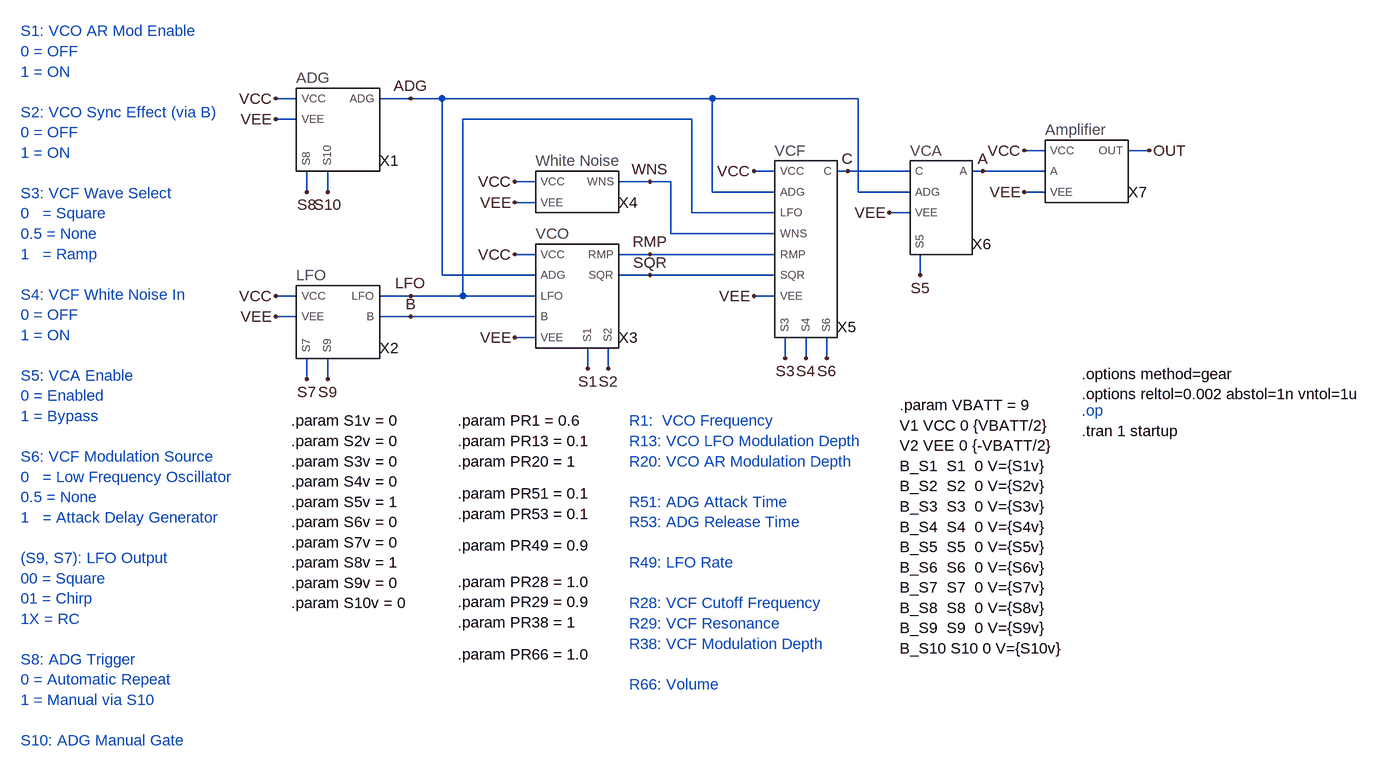
[diagram p0: schematic NoiseToaster.asc]
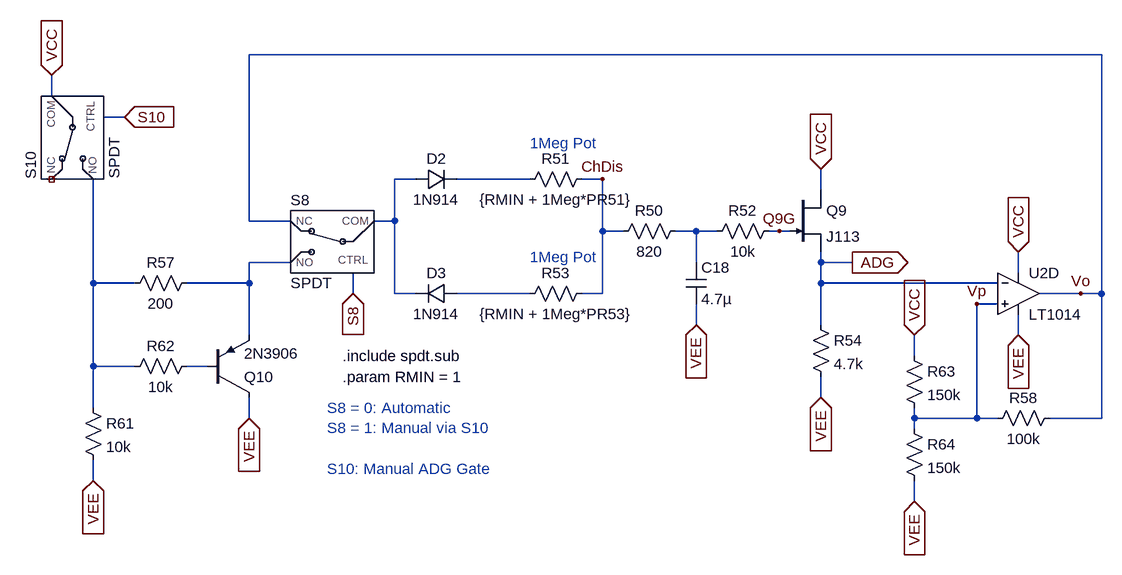
[diagram p1: sub-circuit adg.asc]
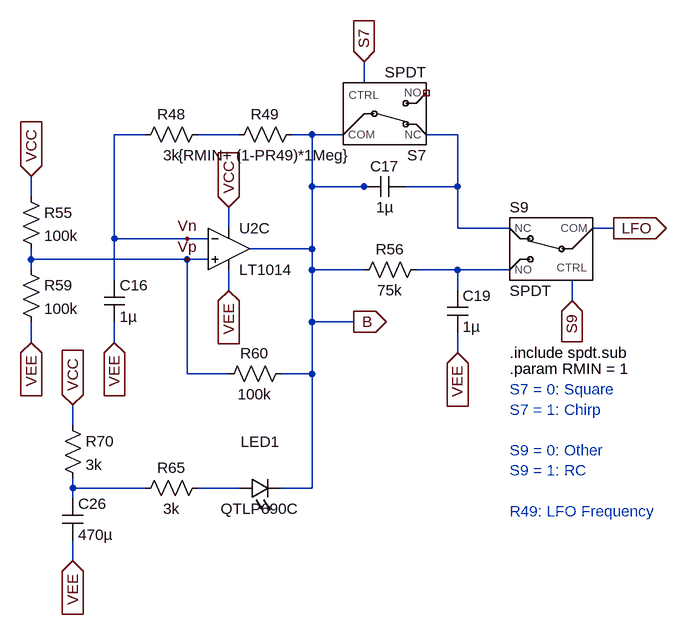
[diagram p2: sub-circuit lfo.asc]
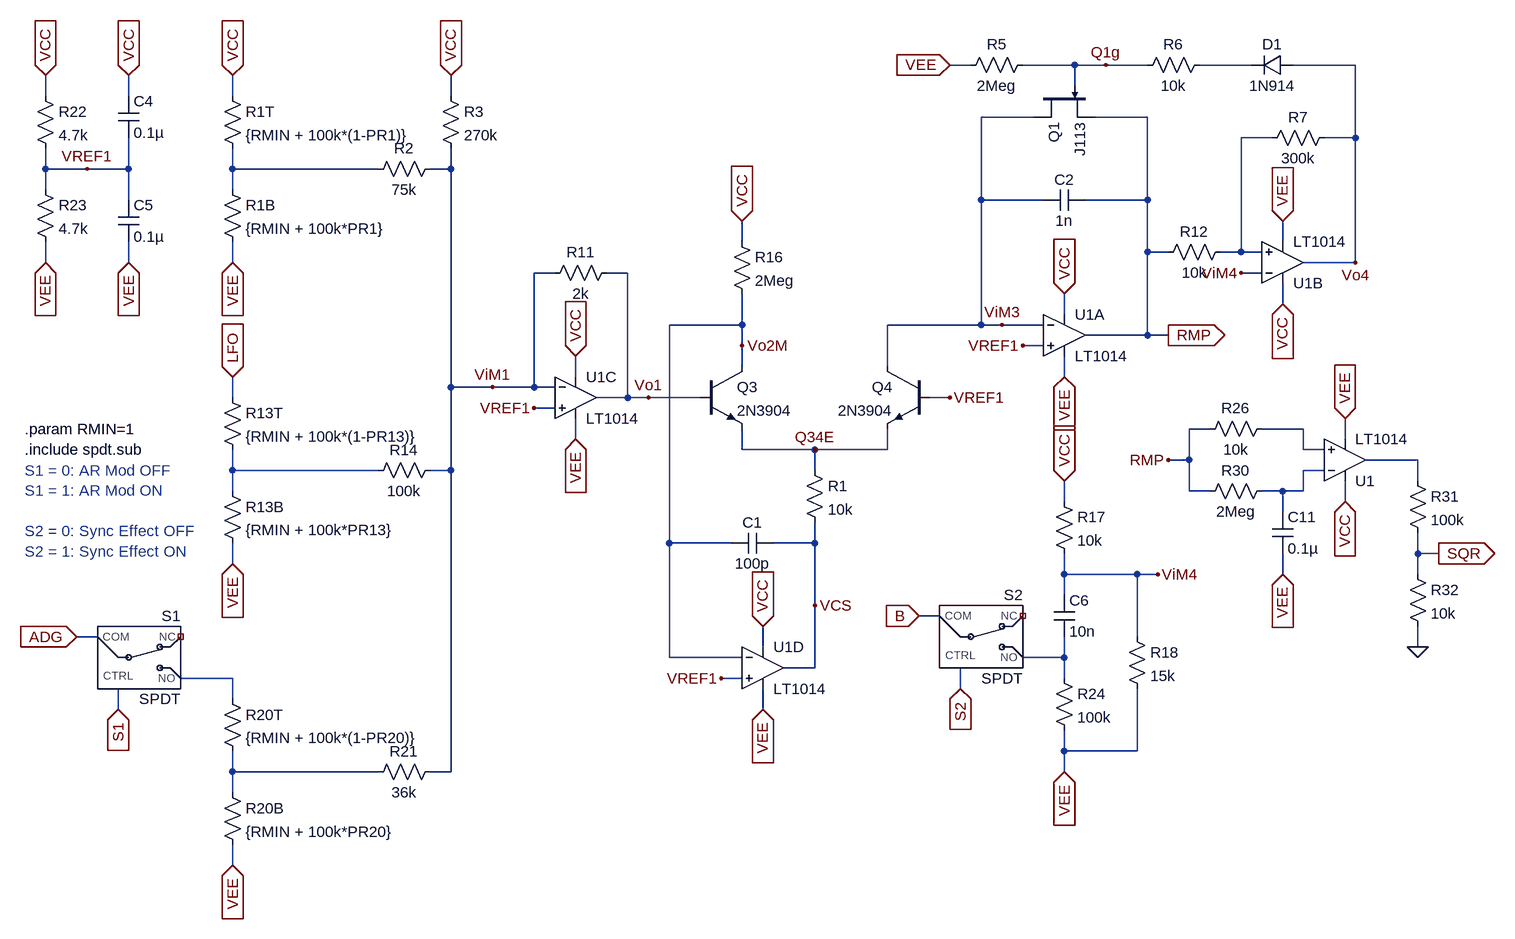
[diagram p3: sub-circuit vco.asc]
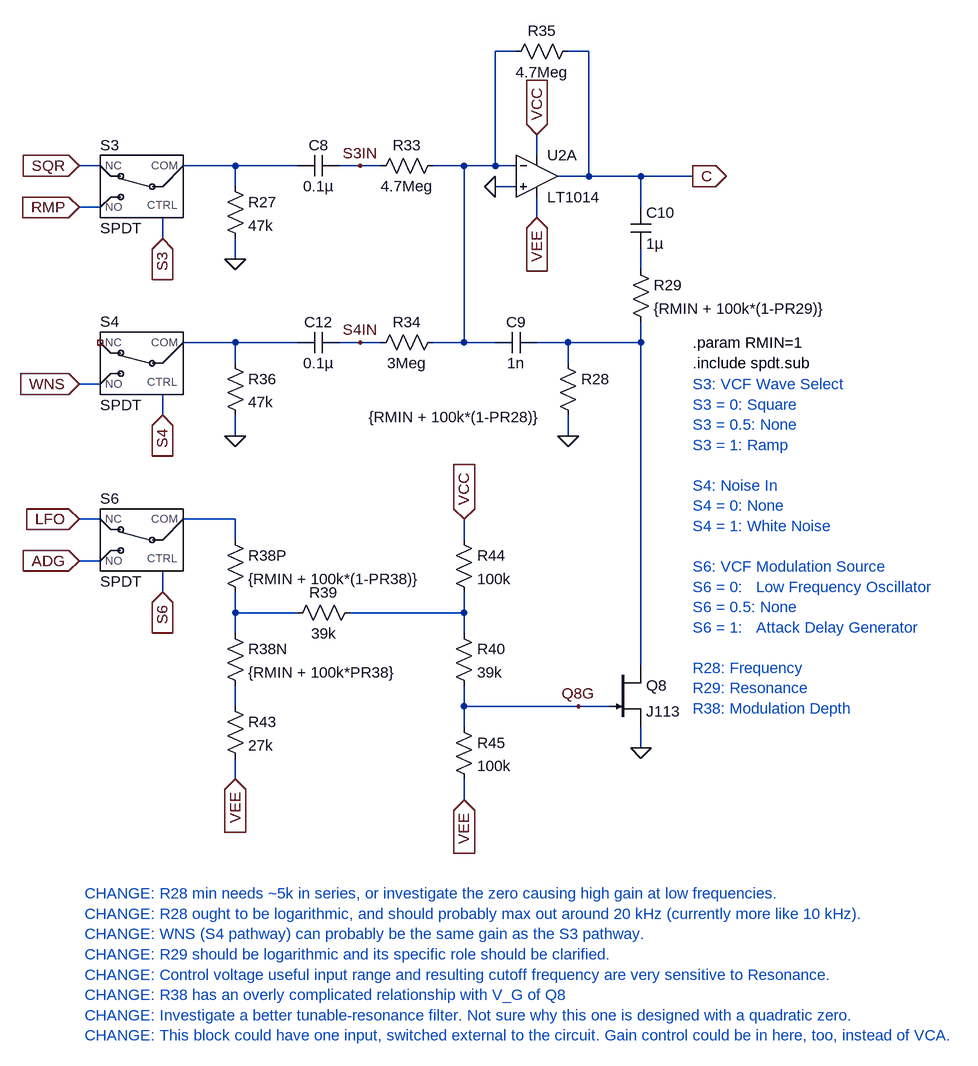
[diagram p4: sub-circuit vcf.asc]
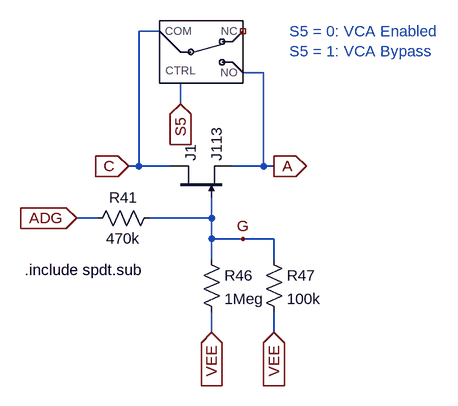
[diagram p5: sub-circuit vca.asc]
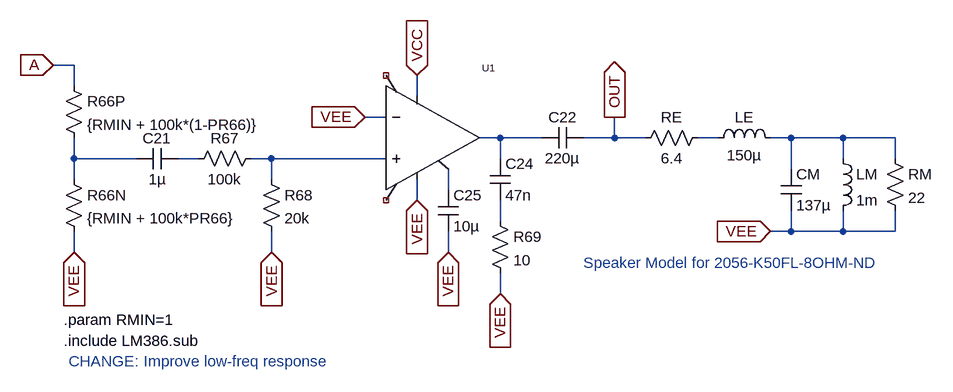
[diagram p6: sub-circuit amplifier.asc]
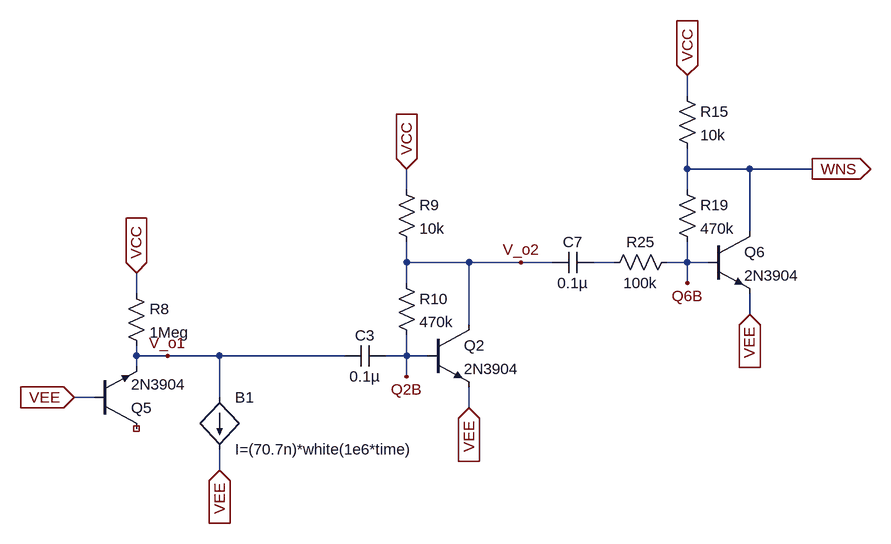
[diagram p7: sub-circuit whitenoise.asc]
NoiseToaster.asc, the LTspice schematic file:
Version 4.1
SHEET 1 1632 1272
WIRE -160 160 -192 160
WIRE 16 160 -32 160
WIRE 64 160 16 160
WIRE 480 160 64 160
WIRE 704 160 480 160
WIRE -160 192 -192 192
WIRE 448 192 96 192
WIRE 992 240 960 240
WIRE 1152 240 1120 240
WIRE 576 272 544 272
WIRE 688 272 672 272
WIRE 784 272 688 272
WIRE 896 272 880 272
WIRE 992 272 896 272
WIRE 208 288 176 288
WIRE 384 288 336 288
WIRE 416 288 384 288
WIRE -144 304 -144 272
WIRE -112 304 -112 272
WIRE 480 304 480 160
WIRE 576 304 480 304
WIRE 704 304 704 160
WIRE 784 304 704 304
WIRE 992 304 960 304
WIRE 208 320 176 320
WIRE 448 336 448 192
WIRE 576 336 448 336
WIRE 784 336 752 336
WIRE 416 368 416 288
WIRE 576 368 416 368
WIRE 208 400 176 400
WIRE 384 400 336 400
WIRE 576 400 384 400
WIRE 64 432 64 160
WIRE 208 432 64 432
WIRE 384 432 336 432
WIRE 576 432 384 432
WIRE 800 432 800 400
WIRE -160 464 -192 464
WIRE 16 464 -32 464
WIRE 96 464 96 192
WIRE 96 464 16 464
WIRE 208 464 96 464
WIRE 576 464 544 464
WIRE -160 496 -192 496
WIRE 16 496 -32 496
WIRE 208 496 16 496
WIRE 208 528 176 528
WIRE 592 560 592 528
WIRE 624 560 624 528
WIRE 656 560 656 528
WIRE 288 576 288 544
WIRE 320 576 320 544
WIRE -144 592 -144 560
WIRE -112 592 -112 560
FLAG -192 464 VCC
FLAG -192 160 VCC
FLAG 176 400 VCC
FLAG 176 288 VCC
FLAG 544 272 VCC
FLAG 960 240 VCC
FLAG -192 496 VEE
FLAG 176 528 VEE
FLAG -192 192 VEE
FLAG 544 464 VEE
FLAG 176 320 VEE
FLAG 752 336 VEE
FLAG 960 304 VEE
FLAG 288 576 S1
FLAG 320 576 S2
FLAG 592 560 S3
FLAG 624 560 S4
FLAG 800 432 S5
FLAG 656 560 S6
FLAG -144 592 S7
FLAG -112 592 S9
FLAG -144 304 S8
FLAG -112 304 S10
FLAG 1152 240 OUT
FLAG 896 272 A
FLAG 688 272 C
FLAG 16 160 ADG
FLAG 16 464 LFO
FLAG 16 496 B
FLAG 384 400 RMP
FLAG 384 432 SQR
FLAG 384 288 WNS
SYMBOL ADG -96 208 R0
SYMATTR InstName X1
SYMATTR SpiceLine PR51={PR51} PR53={PR53}
SYMBOL LFO -96 496 R0
SYMATTR InstName X2
SYMATTR SpiceLine PR49={PR49}
SYMBOL VCO 272 528 R0
SYMATTR InstName X3
SYMATTR SpiceLine PR1={PR1} PR13={PR13} PR20={PR20}
SYMBOL VCF 624 416 R0
SYMATTR InstName X5
SYMBOL VCA 832 320 R0
SYMATTR InstName X6
SYMBOL Amplifier 1040 272 R0
SYMATTR InstName X7
SYMATTR SpiceLine PR66={PR66}
SYMBOL WhiteNoise 224 288 R0
SYMATTR InstName X4
TEXT -584 56 Left 2 ;S1: VCO AR Mod Enable\n0 = OFF\n1 = ON\n \nS2: VCO Sync Effect (via B)\n0 = OFF\n1 = ON\n \nS3: VCF Wave Select\n0   = Square\n0.5 = None\n1   = Ramp\n \nS4: VCF White Noise In\n0 = OFF\n1 = ON\n \nS5: VCA Enable\n0 = Enabled\n1 = Bypass\n \nS6: VCF Modulation Source\n0   = Low Frequency Oscillator\n0.5 = None\n1   = Attack Delay Generator\n \n(S9, S7): LFO Output\n00 = Square\n01 = Chirp\n1X = RC\n \nS8: ADG Trigger\n0 = Automatic Repeat\n1 = Manual via S10\n \nS10: ADG Manual Gate
TEXT 352 656 Left 2 ;R1:  VCO Frequency\nR13: VCO LFO Modulation Depth\nR20: VCO AR Modulation Depth\n \nR51: ADG Attack Time\nR53: ADG Release Time\n \nR49: LFO Rate\n \nR28: VCF Cutoff Frequency\nR29: VCF Resonance\nR38: VCF Modulation Depth\n \nR66: Volume
TEXT 88 768 Left 2 !.param PR51 = 0.1\n.param PR53 = 0.1
TEXT 88 656 Left 2 !.param PR1 = 0.6\n.param PR13 = 0.1\n.param PR20 = 1
TEXT 1048 584 Left 2 !.options method=gear\n.options reltol=0.002 abstol=1n vntol=1u
TEXT 88 904 Left 2 !.param PR28 = 1.0\n.param PR29 = 0.9\n.param PR38 = 1
TEXT 88 848 Left 2 !.param PR49 = 0.9
TEXT 88 1016 Left 2 !.param PR66 = 1.0
TEXT -168 656 Left 2 !.param S1v = 0\n.param S2v = 0\n.param S3v = 0\n.param S4v = 0\n.param S5v = 1\n.param S6v = 0\n.param S7v = 0\n.param S8v = 1\n.param S9v = 0\n.param S10v = 0
TEXT 768 632 Left 2 !.param VBATT = 9\nV1 VCC 0 {VBATT/2}\nV2 VEE 0 {-VBATT/2}\nB_S1  S1  0 V={S1v}\nB_S2  S2  0 V={S2v}\nB_S3  S3  0 V={S3v}\nB_S4  S4  0 V={S4v}\nB_S5  S5  0 V={S5v}\nB_S6  S6  0 V={S6v}\nB_S7  S7  0 V={S7v}\nB_S8  S8  0 V={S8v}\nB_S9  S9  0 V={S9v}\nB_S10 S10 0 V={S10v}
TEXT 1048 640 Left 2 ;.op
TEXT 1048 672 Left 2 !.tran 1 startup

adg.asc, the sub-circuit schematic file:
Version 4.1
SHEET 1 1576 980
WIRE 1568 -48 256 -48
WIRE -48 16 -48 -16
WIRE 64 48 32 48
WIRE 512 144 480 144
WIRE 688 144 576 144
WIRE 800 144 768 144
WIRE 1136 160 1136 128
WIRE 256 208 256 -48
WIRE 320 208 256 208
WIRE 480 208 480 144
WIRE 480 208 448 208
WIRE 800 224 800 144
WIRE 832 224 800 224
WIRE 944 224 912 224
WIRE 976 224 944 224
WIRE 1072 224 1056 224
WIRE 1088 224 1072 224
WIRE 320 272 256 272
WIRE 944 272 944 224
WIRE 1136 272 1136 256
WIRE 1184 272 1136 272
WIRE 1440 288 1440 256
WIRE 16 304 16 144
WIRE 80 304 16 304
WIRE 256 304 256 272
WIRE 256 304 160 304
WIRE 1136 304 1136 272
WIRE 1408 304 1136 304
WIRE 416 320 416 288
WIRE 480 320 480 208
WIRE 512 320 480 320
WIRE 688 320 576 320
WIRE 800 320 800 224
WIRE 800 320 768 320
WIRE 1536 320 1472 320
WIRE 1568 320 1568 -48
WIRE 1568 320 1536 320
WIRE 1408 336 1376 336
WIRE 944 368 944 336
WIRE 1136 368 1136 304
WIRE 256 384 256 304
WIRE 1440 384 1440 352
WIRE 1280 416 1280 384
WIRE 16 432 16 304
WIRE 80 432 16 432
WIRE 192 432 160 432
WIRE 1136 480 1136 448
WIRE 16 496 16 432
WIRE 256 512 256 480
WIRE 1280 512 1280 496
WIRE 1376 512 1376 336
WIRE 1376 512 1280 512
WIRE 1408 512 1376 512
WIRE 1568 512 1568 320
WIRE 1568 512 1488 512
WIRE 1280 528 1280 512
WIRE 16 608 16 576
WIRE 1280 640 1280 608
FLAG -48 -16 VCC
IOPIN -48 -16 In
FLAG 16 608 VEE
IOPIN 16 608 In
FLAG 256 512 VEE
IOPIN 256 512 In
FLAG 64 48 S10
IOPIN 64 48 In
FLAG 416 320 S8
IOPIN 416 320 In
FLAG 944 368 VEE
IOPIN 944 368 In
FLAG 1136 128 VCC
IOPIN 1136 128 In
FLAG 1136 480 VEE
IOPIN 1136 480 In
FLAG 1440 256 VCC
IOPIN 1440 256 In
FLAG 1440 384 VEE
IOPIN 1440 384 In
FLAG 1184 272 ADG
IOPIN 1184 272 Out
FLAG 1280 384 VCC
IOPIN 1280 384 In
FLAG 1280 640 VEE
IOPIN 1280 640 In
FLAG 1072 224 Q9G
FLAG 1376 336 Vp
FLAG 1536 320 Vo
FLAG 800 144 ChDis
SYMBOL njf 1088 160 R0
SYMATTR InstName Q9
SYMATTR Value J113
SYMBOL res 0 480 R0
SYMATTR InstName R61
SYMATTR Value 10k
SYMBOL res 176 416 R90
WINDOW 0 0 56 VBottom 2
WINDOW 3 32 56 VTop 2
SYMATTR InstName R62
SYMATTR Value 10k
SYMBOL res 176 288 R90
WINDOW 0 0 56 VBottom 2
WINDOW 3 32 56 VTop 2
SYMATTR InstName R57
SYMATTR Value 200
SYMBOL pnp 192 480 M180
SYMATTR InstName Q10
SYMATTR Value 2N3906
SYMBOL diode 512 160 R270
WINDOW 0 32 32 VTop 2
WINDOW 3 0 32 VBottom 2
SYMATTR InstName D2
SYMATTR Value 1N914
SYMBOL diode 576 304 R90
WINDOW 0 0 32 VBottom 2
WINDOW 3 32 32 VTop 2
SYMATTR InstName D3
SYMATTR Value 1N914
SYMBOL res 784 128 R90
WINDOW 0 0 56 VBottom 2
WINDOW 3 32 56 VTop 2
SYMATTR InstName R51
SYMATTR Value {RMIN + 1Meg*PR51}
SYMBOL res 784 304 R90
WINDOW 0 0 56 VBottom 2
WINDOW 3 32 56 VTop 2
SYMATTR InstName R53
SYMATTR Value {RMIN + 1Meg*PR53}
SYMBOL res 928 208 R90
WINDOW 0 0 56 VBottom 2
WINDOW 3 32 56 VTop 2
SYMATTR InstName R50
SYMATTR Value 820
SYMBOL res 1072 208 R90
WINDOW 0 0 56 VBottom 2
WINDOW 3 32 56 VTop 2
SYMATTR InstName R52
SYMATTR Value 10k
SYMBOL cap 928 272 R0
SYMATTR InstName C18
SYMATTR Value 4.7µ
SYMBOL res 1120 352 R0
SYMATTR InstName R54
SYMATTR Value 4.7k
SYMBOL OpAmps\\LT1014 1440 256 R0
SYMATTR InstName U2D
SYMBOL res 1264 400 R0
SYMATTR InstName R63
SYMATTR Value 150k
SYMBOL res 1264 512 R0
SYMATTR InstName R64
SYMATTR Value 150k
SYMBOL res 1504 496 R90
WINDOW 0 0 56 VBottom 2
WINDOW 3 32 56 VTop 2
SYMATTR InstName R58
SYMATTR Value 100k
SYMBOL spdt -16 48 R270
SYMATTR InstName S10
SYMBOL spdt 416 240 R0
SYMATTR InstName S8
TEXT 400 416 Left 2 !.include spdt.sub
TEXT 376 496 Left 2 ;S8 = 0: Automatic\nS8 = 1: Manual via S10\n \nS10: Manual ADG Gate
TEXT 688 88 Left 2 ;1Meg Pot
TEXT 688 264 Left 2 ;1Meg Pot
TEXT 400 448 Left 2 !.param RMIN = 1

lfo.asc, the sub-circuit schematic file:
Version 4.1
SHEET 1 1112 792
WIRE 256 -96 256 -128
WIRE -80 -16 -128 -16
WIRE 64 -16 0 -16
WIRE 176 -16 144 -16
WIRE 224 -16 176 -16
WIRE 400 -16 352 -16
WIRE 176 64 176 -16
WIRE 256 64 176 64
WIRE 272 64 256 64
WIRE 400 64 400 -16
WIRE 400 64 320 64
WIRE -256 80 -256 48
WIRE 48 128 48 96
WIRE 400 128 400 64
WIRE 480 128 400 128
WIRE 640 128 608 128
WIRE -128 144 -128 -16
WIRE -16 144 -128 144
WIRE 16 144 -16 144
WIRE 176 160 176 64
WIRE 176 160 80 160
WIRE -256 176 -256 160
WIRE -16 176 -256 176
WIRE 16 176 -16 176
WIRE -256 192 -256 176
WIRE 176 192 176 160
WIRE 256 192 176 192
WIRE 400 192 336 192
WIRE 480 192 400 192
WIRE -128 208 -128 144
WIRE 48 224 48 192
WIRE 400 224 400 192
WIRE 576 240 576 208
WIRE 176 272 176 192
WIRE 240 272 176 272
WIRE -256 304 -256 272
WIRE -128 304 -128 272
WIRE 400 320 400 288
WIRE -16 352 -16 176
WIRE 48 352 -16 352
WIRE 176 352 176 272
WIRE 176 352 128 352
WIRE -192 432 -192 400
WIRE -192 528 -192 512
WIRE -80 528 -192 528
WIRE 64 528 0 528
WIRE 176 528 176 352
WIRE 176 528 128 528
WIRE -192 544 -192 528
WIRE -192 640 -192 608
FLAG 256 -128 S7
IOPIN 256 -128 In
FLAG 576 240 S9
IOPIN 576 240 In
FLAG 48 96 VCC
IOPIN 48 96 In
FLAG 48 224 VEE
IOPIN 48 224 In
FLAG -256 48 VCC
IOPIN -256 48 In
FLAG -256 304 VEE
IOPIN -256 304 In
FLAG -16 176 Vp
FLAG -128 304 VEE
IOPIN -128 304 In
FLAG -16 144 Vn
FLAG 240 272 B
IOPIN 240 272 Out
FLAG 400 320 VEE
IOPIN 400 320 In
FLAG 640 128 LFO
IOPIN 640 128 Out
FLAG -192 400 VCC
IOPIN -192 400 In
FLAG -192 640 VEE
IOPIN -192 640 In
SYMBOL OpAmps\\LT1014 48 96 R0
SYMATTR InstName U2C
SYMBOL res -272 64 R0
SYMATTR InstName R55
SYMATTR Value 100k
SYMBOL res -272 176 R0
SYMATTR InstName R59
SYMATTR Value 100k
SYMBOL res 144 336 R90
WINDOW 0 0 56 VBottom 2
WINDOW 3 32 56 VTop 2
SYMATTR InstName R60
SYMATTR Value 100k
SYMBOL spdt 256 -48 R180
SYMATTR InstName S7
SYMBOL spdt 576 160 R0
SYMATTR InstName S9
SYMBOL cap -144 208 R0
SYMATTR InstName C16
SYMATTR Value 1µ
SYMBOL res 16 -32 R90
WINDOW 0 0 56 VBottom 2
WINDOW 3 32 56 VTop 2
SYMATTR InstName R48
SYMATTR Value 3k
SYMBOL res 160 -32 R90
WINDOW 0 0 56 VBottom 2
WINDOW 3 32 56 VTop 2
SYMATTR InstName R49
SYMATTR Value {RMIN+ (1-PR49)*1Meg}
SYMBOL res 352 176 R90
WINDOW 0 0 56 VBottom 2
WINDOW 3 32 56 VTop 2
SYMATTR InstName R56
SYMATTR Value 75k
SYMBOL cap 384 224 R0
SYMATTR InstName C19
SYMATTR Value 1µ
SYMBOL cap 320 48 R90
WINDOW 0 0 32 VBottom 2
WINDOW 3 32 32 VTop 2
SYMATTR InstName C17
SYMATTR Value 1µ
SYMBOL LED 64 544 R270
WINDOW 0 72 32 VTop 2
WINDOW 3 0 32 VBottom 2
SYMATTR InstName LED1
SYMATTR Value QTLP690C
SYMBOL res -208 416 R0
SYMATTR InstName R70
SYMATTR Value 3k
SYMBOL cap -208 544 R0
SYMATTR InstName C26
SYMATTR Value 470µ
SYMBOL res 16 512 R90
WINDOW 0 0 56 VBottom 2
WINDOW 3 32 56 VTop 2
SYMATTR InstName R65
SYMATTR Value 3k
TEXT 480 344 Left 2 !.param RMIN = 1
TEXT 480 376 Left 2 ;S7 = 0: Square\nS7 = 1: Chirp\n \nS9 = 0: Other\nS9 = 1: RC\n \nR49: LFO Frequency
TEXT 480 320 Left 2 !.include spdt.sub

vco.asc, the sub-circuit schematic file:
Version 4.1
SHEET 1 2252 1144
WIRE 1248 -336 1216 -336
WIRE 1408 -336 1328 -336
WIRE 1456 -336 1408 -336
WIRE 1520 -336 1456 -336
WIRE 1680 -336 1600 -336
WIRE 1840 -336 1744 -336
WIRE 1408 -304 1408 -336
WIRE -176 -288 -176 -320
WIRE -48 -288 -48 -320
WIRE 112 -288 112 -320
WIRE 448 -288 448 -320
WIRE 1344 -256 1264 -256
WIRE 1520 -256 1440 -256
WIRE 1712 -224 1664 -224
WIRE 1840 -224 1840 -336
WIRE 1840 -224 1792 -224
WIRE -176 -176 -176 -208
WIRE -112 -176 -176 -176
WIRE -48 -176 -48 -224
WIRE -48 -176 -112 -176
WIRE 112 -176 112 -208
WIRE 336 -176 112 -176
WIRE 448 -176 448 -208
WIRE 448 -176 416 -176
WIRE -176 -144 -176 -176
WIRE 112 -144 112 -176
WIRE -48 -128 -48 -176
WIRE 1264 -128 1264 -256
WIRE 1360 -128 1264 -128
WIRE 1520 -128 1520 -256
WIRE 1520 -128 1424 -128
WIRE 896 -64 896 -96
WIRE 1728 -64 1728 -96
WIRE 1520 -48 1520 -128
WIRE 1552 -48 1520 -48
WIRE 1664 -48 1664 -224
WIRE 1664 -48 1632 -48
WIRE 1696 -48 1664 -48
WIRE -176 -32 -176 -64
WIRE -48 -32 -48 -64
WIRE 112 -32 112 -64
WIRE 1840 -32 1840 -224
WIRE 1840 -32 1760 -32
WIRE 608 -16 576 -16
WIRE 720 -16 688 -16
WIRE 1696 -16 1664 -16
WIRE 1728 32 1728 0
WIRE 1392 48 1392 16
WIRE 896 64 896 16
WIRE 896 64 784 64
WIRE 1264 64 1264 -128
WIRE 1264 64 1120 64
WIRE 1296 64 1264 64
WIRE 1360 64 1296 64
WIRE 1520 80 1520 -48
WIRE 1520 80 1424 80
WIRE 1552 80 1520 80
WIRE 896 96 896 64
WIRE 1360 96 1328 96
WIRE 896 128 896 96
WIRE 1120 128 1120 64
WIRE 640 144 640 112
WIRE 1392 144 1392 112
WIRE 448 160 448 -176
WIRE 512 160 448 160
WIRE 576 160 576 -16
WIRE 576 160 512 160
WIRE 608 160 576 160
WIRE 112 176 112 144
WIRE 720 176 720 -16
WIRE 720 176 672 176
WIRE 752 176 720 176
WIRE 832 176 752 176
WIRE 1216 176 1184 176
WIRE 608 192 576 192
WIRE 1616 224 1584 224
WIRE 1760 224 1696 224
WIRE 640 240 640 208
WIRE 1824 240 1824 208
WIRE 896 256 896 224
WIRE 1008 256 896 256
WIRE 1120 256 1120 224
WIRE 1120 256 1008 256
WIRE 1760 256 1760 224
WIRE 1792 256 1760 256
WIRE 1584 272 1584 224
WIRE 1584 272 1552 272
WIRE 1936 272 1856 272
WIRE 112 288 112 256
WIRE 336 288 112 288
WIRE 448 288 448 160
WIRE 448 288 416 288
WIRE 1008 288 1008 256
WIRE 1792 288 1760 288
WIRE 1936 304 1936 272
WIRE 112 320 112 288
WIRE 1584 320 1584 272
WIRE 1616 320 1584 320
WIRE 1728 320 1696 320
WIRE 1760 320 1760 288
WIRE 1760 320 1728 320
WIRE 1392 336 1392 304
WIRE 1824 336 1824 304
WIRE 1728 352 1728 320
WIRE 784 400 784 64
WIRE 880 400 784 400
WIRE 1008 400 1008 368
WIRE 1008 400 944 400
WIRE 1936 416 1936 384
WIRE 1968 416 1936 416
WIRE 112 432 112 400
WIRE 1392 448 1392 416
WIRE 1504 448 1392 448
WIRE 1536 448 1504 448
WIRE 1728 448 1728 416
WIRE 1936 448 1936 416
WIRE 1392 480 1392 448
WIRE 1008 496 1008 400
WIRE 1200 512 1168 512
WIRE -96 544 -128 544
WIRE 1504 544 1504 448
WIRE 928 560 928 528
WIRE 1936 560 1936 528
WIRE 784 576 784 400
WIRE 896 576 784 576
WIRE 1392 576 1392 544
WIRE 1392 576 1328 576
WIRE 1008 592 1008 496
WIRE 1008 592 960 592
WIRE 112 608 32 608
WIRE 896 608 864 608
WIRE 1392 608 1392 576
WIRE 1232 624 1232 592
WIRE 112 640 112 608
WIRE -64 656 -64 624
WIRE 928 656 928 624
WIRE 1392 720 1392 688
WIRE 1504 720 1504 624
WIRE 1504 720 1392 720
WIRE 112 752 112 720
WIRE 336 752 112 752
WIRE 448 752 448 288
WIRE 448 752 416 752
WIRE 1392 752 1392 720
WIRE 112 784 112 752
WIRE 112 896 112 864
FLAG 112 -32 VEE
IOPIN 112 -32 In
FLAG 112 -320 VCC
IOPIN 112 -320 In
FLAG 112 432 VEE
IOPIN 112 432 In
FLAG 112 144 LFO
IOPIN 112 144 In
FLAG 112 896 VEE
IOPIN 112 896 In
FLAG -128 544 ADG
IOPIN -128 544 In
FLAG -64 656 S1
IOPIN -64 656 In
FLAG 640 112 VCC
IOPIN 640 112 In
FLAG 640 240 VEE
IOPIN 640 240 In
FLAG 448 -320 VCC
IOPIN 448 -320 In
FLAG 576 192 VREF1
FLAG 896 -96 VCC
IOPIN 896 -96 In
FLAG 928 528 VCC
IOPIN 928 528 In
FLAG 928 656 VEE
IOPIN 928 656 In
FLAG 864 608 VREF1
FLAG 1216 176 VREF1
FLAG 1392 16 VCC
IOPIN 1392 16 In
FLAG 1392 144 VEE
IOPIN 1392 144 In
FLAG 1328 96 VREF1
FLAG 1216 -336 VEE
IOPIN 1216 -336 In
FLAG 1728 -96 VEE
IOPIN 1728 -96 In
FLAG 1728 32 VCC
IOPIN 1728 32 In
FLAG 1552 80 RMP
IOPIN 1552 80 Out
FLAG 1392 752 VEE
IOPIN 1392 752 In
FLAG 1392 304 VCC
IOPIN 1392 304 In
FLAG 1168 512 B
IOPIN 1168 512 In
FLAG 1232 624 S2
IOPIN 1232 624 In
FLAG 1824 208 VEE
IOPIN 1824 208 In
FLAG 1824 336 VCC
IOPIN 1824 336 In
FLAG 1728 448 VEE
IOPIN 1728 448 In
FLAG 1936 560 0
FLAG 1968 416 SQR
IOPIN 1968 416 Out
FLAG 1664 -16 ViM4
FLAG 1536 448 ViM4
FLAG 1552 272 RMP
FLAG 752 176 Vo1
FLAG 1296 64 ViM3
FLAG -176 -32 VEE
IOPIN -176 -32 In
FLAG -176 -320 VCC
IOPIN -176 -320 In
FLAG -48 -32 VEE
IOPIN -48 -32 In
FLAG -48 -320 VCC
IOPIN -48 -320 In
FLAG -112 -176 VREF1
FLAG 1840 -32 Vo4
FLAG 1456 -336 Q1g
FLAG 896 96 Vo2M
FLAG 1008 256 Q34E
FLAG 1008 496 VCS
FLAG 512 160 ViM1
SYMBOL npn 832 128 R0
SYMATTR InstName Q3
SYMATTR Value 2N3904
SYMBOL njf 1344 -304 M90
SYMATTR InstName Q1
SYMATTR Value J113
SYMBOL diode 1744 -320 M270
WINDOW 0 32 32 VTop 2
WINDOW 3 0 32 VBottom 2
SYMATTR InstName D1
SYMATTR Value 1N914
SYMBOL res 96 -304 R0
SYMATTR InstName R1T
SYMATTR Value {RMIN + 100k*(1-PR1)}
SYMBOL res 96 -160 R0
SYMATTR InstName R1B
SYMATTR Value {RMIN + 100k*PR1}
SYMBOL res 432 -192 R90
WINDOW 0 0 56 VBottom 2
WINDOW 3 32 56 VTop 2
SYMATTR InstName R2
SYMATTR Value 75k
SYMBOL res 96 160 R0
SYMATTR InstName R13T
SYMATTR Value {RMIN + 100k*(1-PR13)}
SYMBOL res 96 304 R0
SYMATTR InstName R13B
SYMATTR Value {RMIN + 100k*PR13}
SYMBOL res 432 272 R90
WINDOW 0 0 56 VBottom 2
WINDOW 3 32 56 VTop 2
SYMATTR InstName R14
SYMATTR Value 100k
SYMBOL res 96 624 R0
SYMATTR InstName R20T
SYMATTR Value {RMIN + 100k*(1-PR20)}
SYMBOL res 96 768 R0
SYMATTR InstName R20B
SYMATTR Value {RMIN + 100k*PR20}
SYMBOL res 432 736 R90
WINDOW 0 0 56 VBottom 2
WINDOW 3 32 56 VTop 2
SYMATTR InstName R21
SYMATTR Value 36k
SYMBOL spdt -64 576 M0
SYMATTR InstName S1
SYMBOL OpAmps\\LT1014 640 112 R0
SYMATTR InstName U1C
SYMBOL res 432 -304 R0
SYMATTR InstName R3
SYMATTR Value 270k
SYMBOL res 704 -32 R90
WINDOW 0 0 56 VBottom 2
WINDOW 3 32 56 VTop 2
SYMATTR InstName R11
SYMATTR Value 2k
SYMBOL res 880 -80 R0
SYMATTR InstName R16
SYMATTR Value 2Meg
SYMBOL npn 1184 128 M0
SYMATTR InstName Q4
SYMATTR Value 2N3904
SYMBOL res 992 272 R0
SYMATTR InstName R1
SYMATTR Value 10k
SYMBOL OpAmps\\LT1014 928 528 R0
SYMATTR InstName U1D
SYMBOL cap 944 384 R90
WINDOW 0 0 32 VBottom 2
WINDOW 3 32 32 VTop 2
SYMATTR InstName C1
SYMATTR Value 100p
SYMATTR SpiceLine Rser=0.1
SYMBOL OpAmps\\LT1014 1392 16 R0
SYMATTR InstName U1A
SYMBOL cap 1424 -144 R90
WINDOW 0 0 32 VBottom 2
WINDOW 3 32 32 VTop 2
SYMATTR InstName C2
SYMATTR Value 1n
SYMATTR SpiceLine Rser=0.1
SYMBOL res 1232 -320 R270
WINDOW 0 32 56 VTop 2
WINDOW 3 0 56 VBottom 2
SYMATTR InstName R5
SYMATTR Value 2Meg
SYMBOL res 1616 -352 R90
WINDOW 0 0 56 VBottom 2
WINDOW 3 32 56 VTop 2
SYMATTR InstName R6
SYMATTR Value 10k
SYMBOL OpAmps\\LT1014 1728 32 M180
SYMATTR InstName U1B
SYMBOL res 1648 -64 R90
WINDOW 0 0 56 VBottom 2
WINDOW 3 32 56 VTop 2
SYMATTR InstName R12
SYMATTR Value 10k
SYMBOL res 1808 -240 R90
WINDOW 0 0 56 VBottom 2
WINDOW 3 32 56 VTop 2
SYMATTR InstName R7
SYMATTR Value 300k
SYMBOL res 1376 320 R0
SYMATTR InstName R17
SYMATTR Value 10k
SYMBOL res 1376 592 R0
SYMATTR InstName R24
SYMATTR Value 100k
SYMBOL cap 1376 480 R0
SYMATTR InstName C6
SYMATTR Value 10n
SYMATTR SpiceLine Rser=0.1
SYMBOL spdt 1232 544 M0
SYMATTR InstName S2
SYMBOL res 1488 528 R0
SYMATTR InstName R18
SYMATTR Value 15k
SYMBOL OpAmps\\LT1014 1824 336 M180
SYMATTR InstName U1
SYMBOL res 1712 208 R90
WINDOW 0 0 56 VBottom 2
WINDOW 3 32 56 VTop 2
SYMATTR InstName R26
SYMATTR Value 10k
SYMBOL res 1712 304 R90
WINDOW 0 0 56 VBottom 2
WINDOW 3 32 56 VTop 2
SYMATTR InstName R30
SYMATTR Value 2Meg
SYMBOL cap 1712 352 R0
SYMATTR InstName C11
SYMATTR Value 0.1µ
SYMATTR SpiceLine Rser=0.1
SYMBOL res 1920 288 R0
SYMATTR InstName R31
SYMATTR Value 100k
SYMBOL res 1920 432 R0
SYMATTR InstName R32
SYMATTR Value 10k
SYMBOL res -192 -304 R0
SYMATTR InstName R22
SYMATTR Value 4.7k
SYMBOL res -192 -160 R0
SYMATTR InstName R23
SYMATTR Value 4.7k
SYMBOL cap -64 -288 R0
SYMATTR InstName C4
SYMATTR Value 0.1µ
SYMATTR SpiceLine Rser=0.1
SYMBOL cap -64 -128 R0
SYMATTR InstName C5
SYMATTR Value 0.1µ
TEXT -208 288 Left 2 ;S1 = 0: AR Mod OFF\nS1 = 1: AR Mod ON\n \nS2 = 0: Sync Effect OFF\nS2 = 1: Sync Effect ON
TEXT -208 256 Left 2 !.include spdt.sub
TEXT -208 224 Left 2 !.param RMIN=1

vcf.asc, the sub-circuit schematic file:
Version 4.1
SHEET 1 2252 1156
WIRE 544 -352 512 -352
WIRE 656 -352 624 -352
WIRE 576 -192 576 -224
WIRE -96 -176 -128 -176
WIRE 112 -176 32 -176
WIRE 208 -176 112 -176
WIRE 304 -176 272 -176
WIRE 336 -176 304 -176
WIRE 464 -176 416 -176
WIRE 512 -176 512 -352
WIRE 512 -176 464 -176
WIRE 544 -176 512 -176
WIRE 656 -160 656 -352
WIRE 656 -160 608 -160
WIRE 736 -160 656 -160
WIRE 816 -160 736 -160
WIRE 112 -144 112 -176
WIRE 544 -144 512 -144
WIRE -96 -112 -128 -112
WIRE 736 -112 736 -160
WIRE 576 -96 576 -128
WIRE 0 -64 0 -96
WIRE 112 -32 112 -64
WIRE 736 -16 736 -48
WIRE 112 96 32 96
WIRE 208 96 112 96
WIRE 304 96 272 96
WIRE 336 96 304 96
WIRE 464 96 464 -176
WIRE 464 96 416 96
WIRE 512 96 464 96
WIRE 624 96 576 96
WIRE 736 96 736 64
WIRE 736 96 624 96
WIRE 112 128 112 96
WIRE 624 128 624 96
WIRE -96 160 -128 160
WIRE 0 208 0 176
WIRE 112 240 112 208
WIRE 624 240 624 208
WIRE -96 368 -128 368
WIRE 112 368 32 368
WIRE 112 400 112 368
WIRE 464 400 464 368
WIRE -96 432 -128 432
WIRE 0 480 0 448
WIRE 112 512 112 480
WIRE 208 512 112 512
WIRE 464 512 464 480
WIRE 464 512 288 512
WIRE 112 544 112 512
WIRE 464 544 464 512
WIRE 736 592 736 96
WIRE 112 656 112 624
WIRE 464 656 464 624
WIRE 640 656 464 656
WIRE 688 656 640 656
WIRE 464 688 464 656
WIRE 736 720 736 688
WIRE 112 768 112 736
WIRE 464 800 464 768
FLAG 0 -64 S3
IOPIN 0 -64 In
FLAG 576 -224 VCC
IOPIN 576 -224 In
FLAG 576 -96 VEE
IOPIN 576 -96 In
FLAG -128 -176 SQR
IOPIN -128 -176 In
FLAG -128 -112 RMP
IOPIN -128 -112 In
FLAG -128 368 LFO
IOPIN -128 368 In
FLAG -128 432 ADG
IOPIN -128 432 In
FLAG -128 160 WNS
IOPIN -128 160 In
FLAG 0 208 S4
IOPIN 0 208 In
FLAG 0 480 S6
IOPIN 0 480 In
FLAG 112 -32 0
FLAG 112 240 0
FLAG 512 -144 0
FLAG 624 240 0
FLAG 112 768 VEE
IOPIN 112 768 In
FLAG 736 720 0
FLAG 816 -160 C
IOPIN 816 -160 Out
FLAG 464 368 VCC
IOPIN 464 368 In
FLAG 464 800 VEE
IOPIN 464 800 In
FLAG 304 -176 S3IN
FLAG 304 96 S4IN
FLAG 640 656 Q8G
SYMBOL njf 688 592 R0
SYMATTR InstName Q8
SYMATTR Value J113
SYMBOL res 96 -160 R0
SYMATTR InstName R27
SYMATTR Value 47k
SYMBOL res 432 -192 R90
WINDOW 0 0 56 VBottom 2
WINDOW 3 32 56 VTop 2
SYMATTR InstName R33
SYMATTR Value 4.7Meg
SYMBOL spdt 0 -144 R0
SYMATTR InstName S3
SYMBOL OpAmps\\LT1014 576 -224 R0
SYMATTR InstName U2A
SYMBOL res 640 -368 R90
WINDOW 0 0 56 VBottom 2
WINDOW 3 32 56 VTop 2
SYMATTR InstName R35
SYMATTR Value 4.7Meg
SYMBOL spdt 0 400 R0
SYMATTR InstName S6
SYMBOL spdt 0 128 R0
SYMATTR InstName S4
SYMBOL cap 272 -192 R90
WINDOW 0 0 32 VBottom 2
WINDOW 3 32 32 VTop 2
SYMATTR InstName C8
SYMATTR Value 0.1µ
SYMBOL res 96 112 R0
SYMATTR InstName R36
SYMATTR Value 47k
SYMBOL res 432 80 R90
WINDOW 0 0 56 VBottom 2
WINDOW 3 32 56 VTop 2
SYMATTR InstName R34
SYMATTR Value 3Meg
SYMBOL cap 272 80 R90
WINDOW 0 0 32 VBottom 2
WINDOW 3 32 32 VTop 2
SYMATTR InstName C12
SYMATTR Value 0.1µ
SYMBOL res 608 112 R0
WINDOW 3 -291 99 Left 2
SYMATTR Value {RMIN + 100k*(1-PR28)}
SYMATTR InstName R28
SYMBOL cap 576 80 R90
WINDOW 0 0 32 VBottom 2
WINDOW 3 32 32 VTop 2
SYMATTR InstName C9
SYMATTR Value 1n
SYMBOL res 96 384 R0
SYMATTR InstName R38P
SYMATTR Value {RMIN + 100k*(1-PR38)}
SYMBOL res 96 528 R0
SYMATTR InstName R38N
SYMATTR Value {RMIN + 100k*PR38}
SYMBOL res 720 -32 R0
SYMATTR InstName R29
SYMATTR Value {RMIN + 100k*(1-PR29)}
SYMBOL cap 720 -112 R0
SYMATTR InstName C10
SYMATTR Value 1µ
SYMBOL res 96 640 R0
SYMATTR InstName R43
SYMATTR Value 27k
SYMBOL res 304 496 R90
WINDOW 0 0 56 VBottom 2
WINDOW 3 32 56 VTop 2
SYMATTR InstName R39
SYMATTR Value 39k
SYMBOL res 448 384 R0
SYMATTR InstName R44
SYMATTR Value 100k
SYMBOL res 448 528 R0
SYMATTR InstName R40
SYMATTR Value 39k
SYMBOL res 448 672 R0
SYMATTR InstName R45
SYMATTR Value 100k
TEXT 816 160 Left 2 ;S3: VCF Wave Select\nS3 = 0: Square\nS3 = 0.5: None\nS3 = 1: Ramp\n \nS4: Noise In\nS4 = 0: None\nS4 = 1: White Noise\n \nS6: VCF Modulation Source\nS6 = 0:   Low Frequency Oscillator\nS6 = 0.5: None\nS6 = 1:   Attack Delay Generator\n \nR28: Frequency\nR29: Resonance\nR38: Modulation Depth
TEXT 816 128 Left 2 !.include spdt.sub
TEXT 816 96 Left 2 !.param RMIN=1
TEXT -120 944 Left 2 ;CHANGE: R28 min needs ~5k in series, or investigate the zero causing high gain at low frequencies.\nCHANGE: R28 ought to be logarithmic, and should probably max out around 20 kHz (currently more like 10 kHz).\nCHANGE: WNS (S4 pathway) can probably be the same gain as the S3 pathway.\nCHANGE: R29 should be logarithmic and its specific role should be clarified.\nCHANGE: Control voltage useful input range and resulting cutoff frequency are very sensitive to Resonance.\nCHANGE: R38 has an overly complicated relationship with V_G of Q8\nCHANGE: Investigate a better tunable-resonance filter. Not sure why this one is designed with a quadratic zero.\nCHANGE: This block could have one input, switched external to the circuit. Gain control could be in here, too, instead of VCA.

vca.asc, the sub-circuit schematic file:
Version 4.1
SHEET 1 1048 680
WIRE -80 -176 -112 -176
WIRE 80 -112 48 -112
WIRE -48 -64 -48 -96
WIRE -112 32 -112 -176
WIRE -112 32 -128 32
WIRE -64 32 -112 32
WIRE 80 32 80 -112
WIRE 80 32 32 32
WIRE 96 32 80 32
WIRE -176 112 -208 112
WIRE 0 112 0 80
WIRE 0 112 -96 112
WIRE 0 144 0 112
WIRE 48 144 0 144
WIRE 96 144 48 144
WIRE 0 176 0 144
WIRE 96 176 96 144
WIRE 0 288 0 256
WIRE 96 288 96 256
FLAG 0 288 VEE
IOPIN 0 288 In
FLAG 96 288 VEE
IOPIN 96 288 In
FLAG -208 112 ADG
IOPIN -208 112 In
FLAG -128 32 C
IOPIN -128 32 In
FLAG 96 32 A
IOPIN 96 32 Out
FLAG -48 -64 S5
IOPIN -48 -64 In
FLAG 48 144 G
SYMBOL njf -64 80 R270
SYMATTR InstName J1
SYMATTR Value J113
SYMBOL res -16 160 R0
SYMATTR InstName R46
SYMATTR Value 1Meg
SYMBOL res 80 160 R0
SYMATTR InstName R47
SYMATTR Value 100k
SYMBOL res -80 96 R90
WINDOW 0 0 56 VBottom 2
WINDOW 3 32 56 VTop 2
SYMATTR InstName R41
SYMATTR Value 470k
SYMBOL spdt -48 -144 M0
WINDOW 3 0 0 Invisible 0
WINDOW 0 0 28 Invisible 0
SYMATTR InstName S5
TEXT -288 192 Left 2 !.include spdt.sub
TEXT 120 -176 Left 2 ;S5 = 0: VCA Enabled\nS5 = 1: VCA Bypass

amplifier.asc, the sub-circuit schematic file:
Version 4.1
SHEET 1 2252 1156
WIRE 112 368 80 368
WIRE 112 400 112 368
WIRE 640 416 640 384
WIRE 592 448 560 448
WIRE 768 480 736 480
WIRE 832 480 768 480
WIRE 944 480 944 448
WIRE 944 480 896 480
WIRE 992 480 944 480
WIRE 1104 480 1072 480
WIRE 1216 480 1184 480
WIRE 1296 480 1216 480
WIRE 1376 480 1296 480
WIRE 112 512 112 480
WIRE 208 512 112 512
WIRE 304 512 272 512
WIRE 416 512 384 512
WIRE 592 512 416 512
WIRE 768 512 768 480
WIRE 1296 512 1296 480
WIRE 1376 512 1376 480
WIRE 1216 528 1216 480
WIRE 112 544 112 512
WIRE 416 544 416 512
WIRE 688 560 688 528
WIRE 640 576 640 544
WIRE 768 608 768 576
WIRE 1216 624 1216 592
WIRE 1216 624 1184 624
WIRE 1296 624 1296 592
WIRE 1296 624 1216 624
WIRE 1376 624 1376 592
WIRE 1376 624 1296 624
WIRE 112 656 112 624
WIRE 416 656 416 624
WIRE 688 656 688 624
WIRE 768 720 768 688
FLAG 640 384 VCC
IOPIN 640 384 In
FLAG 640 576 VEE
IOPIN 640 576 In
FLAG 112 656 VEE
IOPIN 112 656 In
FLAG 80 368 A
IOPIN 80 368 In
FLAG 416 656 VEE
IOPIN 416 656 In
FLAG 688 656 VEE
IOPIN 688 656 In
FLAG 560 448 VEE
IOPIN 560 448 In
FLAG 768 720 VEE
IOPIN 768 720 In
FLAG 1184 624 VEE
IOPIN 1184 624 In
FLAG 944 448 OUT
IOPIN 944 448 Out
SYMBOL res 96 384 R0
SYMATTR InstName R66P
SYMATTR Value {RMIN + 100k*(1-PR66)}
SYMBOL res 96 528 R0
SYMATTR InstName R66N
SYMATTR Value {RMIN + 100k*PR66}
SYMBOL cap 272 496 R90
WINDOW 0 0 32 VBottom 2
WINDOW 3 32 32 VTop 2
SYMATTR InstName C21
SYMATTR Value 1µ
SYMBOL res 400 496 R90
WINDOW 0 0 56 VBottom 2
WINDOW 3 32 56 VTop 2
SYMATTR InstName R67
SYMATTR Value 100k
SYMBOL res 400 528 R0
SYMATTR InstName R68
SYMATTR Value 20k
SYMBOL LM386 640 480 R0
SYMATTR InstName U1
SYMBOL cap 672 560 R0
SYMATTR InstName C25
SYMATTR Value 10µ
SYMBOL cap 752 512 R0
SYMATTR InstName C24
SYMATTR Value 47n
SYMBOL res 752 592 R0
SYMATTR InstName R69
SYMATTR Value 10
SYMBOL cap 896 464 R90
WINDOW 0 0 32 VBottom 2
WINDOW 3 32 32 VTop 2
SYMATTR InstName C22
SYMATTR Value 220µ
SYMBOL res 1088 464 R90
WINDOW 0 0 56 VBottom 2
WINDOW 3 32 56 VTop 2
SYMATTR InstName RE
SYMATTR Value 6.4
SYMBOL ind 1088 496 R270
WINDOW 0 32 56 VTop 2
WINDOW 3 5 56 VBottom 2
SYMATTR InstName LE
SYMATTR Value 150µ
SYMATTR SpiceLine Rser=1m
SYMBOL cap 1200 528 R0
SYMATTR InstName CM
SYMATTR Value 137µ
SYMBOL ind 1280 496 R0
SYMATTR InstName LM
SYMATTR Value 1m
SYMATTR SpiceLine Rser=1m
SYMBOL res 1360 496 R0
SYMATTR InstName RM
SYMATTR Value 22
TEXT 104 824 Left 2 ;CHANGE: Improve low-freq response
TEXT 96 792 Left 2 !.include LM386.sub
TEXT 896 672 Left 2 ;Speaker Model for 2056-K50FL-8OHM-ND
TEXT 96 760 Left 2 !.param RMIN=1

whitenoise.asc, the sub-circuit schematic file:
Version 4.1
SHEET 1 1048 680
WIRE 656 -256 656 -288
WIRE 656 -144 656 -176
WIRE 752 -144 656 -144
WIRE 848 -144 752 -144
WIRE 224 -112 224 -144
WIRE 656 -112 656 -144
WIRE 752 -48 752 -144
WIRE 224 0 224 -32
WIRE 320 0 224 0
WIRE 400 0 320 0
WIRE 448 0 400 0
WIRE 544 0 512 0
WIRE 656 0 656 -32
WIRE 656 0 624 0
WIRE 688 0 656 0
WIRE 224 32 224 0
WIRE 656 32 656 0
WIRE -192 48 -192 16
WIRE 752 80 752 48
WIRE 320 96 320 0
WIRE -192 144 -192 128
WIRE -144 144 -192 144
WIRE -64 144 -144 144
WIRE 128 144 -64 144
WIRE 224 144 224 112
WIRE 224 144 192 144
WIRE 256 144 224 144
WIRE -192 160 -192 144
WIRE 224 176 224 144
WIRE -256 208 -288 208
WIRE -64 208 -64 144
WIRE 320 224 320 192
WIRE -64 320 -64 288
FLAG -288 208 VEE
IOPIN -288 208 In
FLAG -192 16 VCC
IOPIN -192 16 In
FLAG -144 144 V_o1
FLAG 224 -144 VCC
IOPIN 224 -144 In
FLAG 320 224 VEE
IOPIN 320 224 In
FLAG 400 0 V_o2
FLAG 656 -288 VCC
IOPIN 656 -288 In
FLAG 752 80 VEE
IOPIN 752 80 In
FLAG 848 -144 WNS
IOPIN 848 -144 Out
FLAG -64 320 VEE
IOPIN -64 320 In
FLAG 224 176 Q2B
FLAG 656 32 Q6B
SYMBOL res -208 32 R0
SYMATTR InstName R8
SYMATTR Value 1Meg
SYMBOL npn -256 256 M180
SYMATTR InstName Q5
SYMATTR Value 2N3904
SYMBOL cap 192 128 R90
WINDOW 0 0 32 VBottom 2
WINDOW 3 32 32 VTop 2
SYMATTR InstName C3
SYMATTR Value 0.1µ
SYMBOL res 208 -128 R0
SYMATTR InstName R9
SYMATTR Value 10k
SYMBOL npn 256 96 R0
SYMATTR InstName Q2
SYMATTR Value 2N3904
SYMBOL res 208 16 R0
SYMATTR InstName R10
SYMATTR Value 470k
SYMBOL cap 512 -16 R90
WINDOW 0 0 32 VBottom 2
WINDOW 3 32 32 VTop 2
SYMATTR InstName C7
SYMATTR Value 0.1µ
SYMBOL res 640 -16 R90
WINDOW 0 0 56 VBottom 2
WINDOW 3 32 56 VTop 2
SYMATTR InstName R25
SYMATTR Value 100k
SYMBOL res 640 -272 R0
SYMATTR InstName R15
SYMATTR Value 10k
SYMBOL npn 688 -48 R0
SYMATTR InstName Q6
SYMATTR Value 2N3904
SYMBOL res 640 -128 R0
SYMATTR InstName R19
SYMATTR Value 470k
SYMBOL bi -64 208 R0
SYMATTR InstName B1
SYMATTR Value I=(70.7n)*white(1e6*time)

The netlist it stands for:
* NoiseToaster.asc
X§X1 S10 S8 VCC VEE ADG adg params: PR51={PR51} PR53={PR53}
X§X2 S7 S9 VCC VEE B LFO lfo params: PR49={PR49}
X§X3 ADG B LFO S1 S2 VCC VEE RMP SQR vco params: PR1={PR1} PR13={PR13} PR20={PR20}
X§X5 ADG LFO RMP S3 S4 S6 SQR VCC VEE WNS C vcf
X§X6 ADG C S5 VEE A vca
X§X7 A VCC VEE OUT amplifier params: PR66={PR66}
X§X4 VCC VEE WNS whitenoise

* block symbol definitions
.subckt adg S10 S8 VCC VEE ADG
J§Q9 VCC Q9G ADG J113
R61 N005 VEE 10k
R62 N007 N005 10k
R57 N004 N005 200
Q10 VEE N007 N004 0 2N3906
D2 N001 N002 1N914
D3 N006 N001 1N914
R51 ChDis N002 {RMIN + 1Meg*PR51}
R53 ChDis N006 {RMIN + 1Meg*PR53}
R50 N003 ChDis 820
R52 Q9G N003 10k
C18 N003 VEE 4.7µ
R54 ADG VEE 4.7k
X§U2D Vp ADG VCC VEE Vo LT1014  ; pins In+ In- V+ V- OUT
R63 VCC Vp 150k
R64 Vp VEE 150k
R58 Vo Vp 100k
X§S10 VCC N005 NC_01 S10 SPDT  ; pins COM NO NC CTRL
X§S8 N001 N004 Vo S8 SPDT  ; pins COM NO NC CTRL
.include spdt.sub
* S8 = 0: Automatic
* S8 = 1: Manual via S10
* S10: Manual ADG Gate
* 1Meg Pot
* 1Meg Pot
.param RMIN = 1
.ends adg

.subckt lfo S7 S9 VCC VEE B LFO
X§U2C Vp Vn VCC VEE B LT1014  ; pins In+ In- V+ V- OUT
R55 VCC Vp 100k
R59 Vp VEE 100k
R60 B Vp 100k
X§S7 B NC_01 N002 S7 SPDT  ; pins COM NO NC CTRL
X§S9 LFO N003 N002 S9 SPDT  ; pins COM NO NC CTRL
C16 Vn VEE 1µ
R48 N001 Vn 3k
R49 B N001 {RMIN+ (1-PR49)*1Meg}
R56 N003 B 75k
C19 N003 VEE 1µ
C17 N002 B 1µ
D§LED1 N005 B QTLP690C
R70 VCC N004 3k
C26 N004 VEE 470µ
R65 N005 N004 3k
.param RMIN = 1
* S7 = 0: Square
* S7 = 1: Chirp
* S9 = 0: Other
* S9 = 1: RC
* R49: LFO Frequency
.include spdt.sub
.ends lfo

.subckt vco ADG B LFO S1 S2 VCC VEE RMP SQR
Q3 Vo2M Vo1 Q34E 0 2N3904
J§Q1 ViM3 Q1g RMP J113
D1 Vo4 N001 1N914
R1T VCC N003 {RMIN + 100k*(1-PR1)}
R1B N003 VEE {RMIN + 100k*PR1}
R2 ViM1 N003 75k
R13T LFO N006 {RMIN + 100k*(1-PR13)}
R13B N006 VEE {RMIN + 100k*PR13}
R14 ViM1 N006 100k
R20T N009 N010 {RMIN + 100k*(1-PR20)}
R20B N010 VEE {RMIN + 100k*PR20}
R21 ViM1 N010 36k
X§S1 ADG N009 NC_01 S1 SPDT  ; pins COM NO NC CTRL
X§U1C VREF1 ViM1 VCC VEE Vo1 LT1014  ; pins In+ In- V+ V- OUT
R3 VCC ViM1 270k
R11 Vo1 ViM1 2k
R16 VCC Vo2M 2Meg
Q4 ViM3 VREF1 Q34E 0 2N3904
R1 Q34E VCS 10k
X§U1D VREF1 Vo2M VCC VEE VCS LT1014  ; pins In+ In- V+ V- OUT
C1 VCS Vo2M 100p Rser=0.1
X§U1A VREF1 ViM3 VCC VEE RMP LT1014  ; pins In+ In- V+ V- OUT
C2 RMP ViM3 1n Rser=0.1
R5 VEE Q1g 2Meg
R6 N001 Q1g 10k
X§U1B N002 ViM4 VCC VEE Vo4 LT1014  ; pins In+ In- V+ V- OUT
R12 N002 RMP 10k
R7 Vo4 N002 300k
R17 VCC ViM4 10k
R24 N008 VEE 100k
C6 ViM4 N008 10n Rser=0.1
X§S2 B N008 NC_02 S2 SPDT  ; pins COM NO NC CTRL
R18 ViM4 VEE 15k
X§U1 N004 N007 VCC VEE N005 LT1014  ; pins In+ In- V+ V- OUT
R26 N004 RMP 10k
R30 N007 RMP 2Meg
C11 N007 VEE 0.1µ Rser=0.1
R31 N005 SQR 100k
R32 SQR 0 10k
R22 VCC VREF1 4.7k
R23 VREF1 VEE 4.7k
C4 VCC VREF1 0.1µ Rser=0.1
C5 VREF1 VEE 0.1µ
* S1 = 0: AR Mod OFF
* S1 = 1: AR Mod ON
* S2 = 0: Sync Effect OFF
* S2 = 1: Sync Effect ON
.include spdt.sub
.param RMIN=1
.ends vco

.subckt vcf ADG LFO RMP S3 S4 S6 SQR VCC VEE WNS C
J§Q8 N005 Q8G 0 J113
R27 N002 0 47k
R33 N001 S3IN 4.7Meg
X§S3 N002 RMP SQR S3 SPDT  ; pins COM NO NC CTRL
X§U2A 0 N001 VCC VEE C LT1014  ; pins In+ In- V+ V- OUT
R35 C N001 4.7Meg
X§S6 N006 ADG LFO S6 SPDT  ; pins COM NO NC CTRL
X§S4 N004 WNS NC_01 S4 SPDT  ; pins COM NO NC CTRL
C8 S3IN N002 0.1µ
R36 N004 0 47k
R34 N001 S4IN 3Meg
C12 S4IN N004 0.1µ
R28 N005 0 {RMIN + 100k*(1-PR28)}
C9 N005 N001 1n
R38P N006 N007 {RMIN + 100k*(1-PR38)}
R38N N007 N009 {RMIN + 100k*PR38}
R29 N003 N005 {RMIN + 100k*(1-PR29)}
C10 C N003 1µ
R43 N009 VEE 27k
R39 N008 N007 39k
R44 VCC N008 100k
R40 N008 Q8G 39k
R45 Q8G VEE 100k
* S3: VCF Wave Select
* S3 = 0: Square
* S3 = 0.5: None
* S3 = 1: Ramp
* S4: Noise In
* S4 = 0: None
* S4 = 1: White Noise
* S6: VCF Modulation Source
* S6 = 0:   Low Frequency Oscillator
* S6 = 0.5: None
* S6 = 1:   Attack Delay Generator
* R28: Frequency
* R29: Resonance
* R38: Modulation Depth
.include spdt.sub
.param RMIN=1
* CHANGE: R28 min needs ~5k in series, or investigate the zero causing high gain at low frequencies.
* CHANGE: R28 ought to be logarithmic, and should probably max out around 20 kHz (currently more like 10 kHz).
* CHANGE: WNS (S4 pathway) can probably be the same gain as the S3 pathway.
* CHANGE: R29 should be logarithmic and its specific role should be clarified.
* CHANGE: Control voltage useful input range and resulting cutoff frequency are very sensitive to Resonance.
* CHANGE: R38 has an overly complicated relationship with V_G of Q8
* CHANGE: Investigate a better tunable-resonance filter. Not sure why this one is designed with a quadratic zero.
* CHANGE: This block could have one input, switched external to the circuit. Gain control could be in here, too, instead of VCA.
.ends vcf

.subckt vca ADG C S5 VEE A
J1 C G A J113
R46 G VEE 1Meg
R47 G VEE 100k
R41 G ADG 470k
X§S5 C A NC_01 S5 SPDT  ; pins COM NO NC CTRL
.include spdt.sub
* S5 = 0: VCA Enabled
* S5 = 1: VCA Bypass
.ends vca

.subckt amplifier A VCC VEE OUT
R66P A N004 {RMIN + 100k*(1-PR66)}
R66N N004 VEE {RMIN + 100k*PR66}
C21 N005 N004 1µ
R67 N006 N005 100k
R68 N006 VEE 20k
X§U1 NC_01 VEE N006 VEE N001 VCC N007 NC_02 LM386  ; pins G1 INN INP VSS OUT VDD BYP G8
C25 N007 VEE 10µ
C24 N001 N008 47n
R69 N008 VEE 10
C22 OUT N001 220µ
RE N002 OUT 6.4
LE N002 N003 150µ Rser=1m
CM N003 VEE 137µ
LM N003 VEE 1m Rser=1m
RM N003 VEE 22
* CHANGE: Improve low-freq response
.include LM386.sub
* Speaker Model for 2056-K50FL-8OHM-ND
.param RMIN=1
.ends amplifier

.subckt whitenoise VCC VEE WNS
R8 VCC V_o1 1Meg
Q5 NC_01 VEE V_o1 0 2N3904
C3 Q2B V_o1 0.1µ
R9 VCC V_o2 10k
Q2 V_o2 Q2B VEE 0 2N3904
R10 V_o2 Q2B 470k
C7 N001 V_o2 0.1µ
R25 Q6B N001 100k
R15 VCC WNS 10k
Q6 WNS Q6B VEE 0 2N3904
R19 WNS Q6B 470k
B1 V_o1 VEE I=(70.7n)*white(1e6*time)
.ends whitenoise

.model D D
.lib standard.dio
.model NPN NPN
.model PNP PNP
.lib standard.bjt
.model NJF NJF
.model PJF PJF
.lib standard.jft
* S1: VCO AR Mod Enable
* 0 = OFF
* 1 = ON
* S2: VCO Sync Effect (via B)
* 0 = OFF
* 1 = ON
* S3: VCF Wave Select
* 0   = Square
* 0.5 = None
* 1   = Ramp
* S4: VCF White Noise In
* 0 = OFF
* 1 = ON
* S5: VCA Enable
* 0 = Enabled
* 1 = Bypass
* S6: VCF Modulation Source
* 0   = Low Frequency Oscillator
* 0.5 = None
* 1   = Attack Delay Generator
* (S9, S7): LFO Output
* 00 = Square
* 01 = Chirp
* 1X = RC
* S8: ADG Trigger
* 0 = Automatic Repeat
* 1 = Manual via S10
* S10: ADG Manual Gate
* R1:  VCO Frequency
* R13: VCO LFO Modulation Depth
* R20: VCO AR Modulation Depth
* R51: ADG Attack Time
* R53: ADG Release Time
* R49: LFO Rate
* R28: VCF Cutoff Frequency
* R29: VCF Resonance
* R38: VCF Modulation Depth
* R66: Volume
.param PR51 = 0.1
.param PR53 = 0.1
.param PR1 = 0.6
.param PR13 = 0.1
.param PR20 = 1
.options method=gear
.options reltol=0.002 abstol=1n vntol=1u
.param PR28 = 1.0
.param PR29 = 0.9
.param PR38 = 1
.param PR49 = 0.9
.param PR66 = 1.0
.param S1v = 0
.param S2v = 0
.param S3v = 0
.param S4v = 0
.param S5v = 1
.param S6v = 0
.param S7v = 0
.param S8v = 1
.param S9v = 0
.param S10v = 0
.param VBATT = 9
V1 VCC 0 {VBATT/2}
V2 VEE 0 {-VBATT/2}
B_S1  S1  0 V={S1v}
B_S2  S2  0 V={S2v}
B_S3  S3  0 V={S3v}
B_S4  S4  0 V={S4v}
B_S5  S5  0 V={S5v}
B_S6  S6  0 V={S6v}
B_S7  S7  0 V={S7v}
B_S8  S8  0 V={S8v}
B_S9  S9  0 V={S9v}
B_S10 S10 0 V={S10v}
* .op
.tran 1 startup
.backanno
.end